# EAGLE schematic latchupWatchdog (EAGLE 6.1)
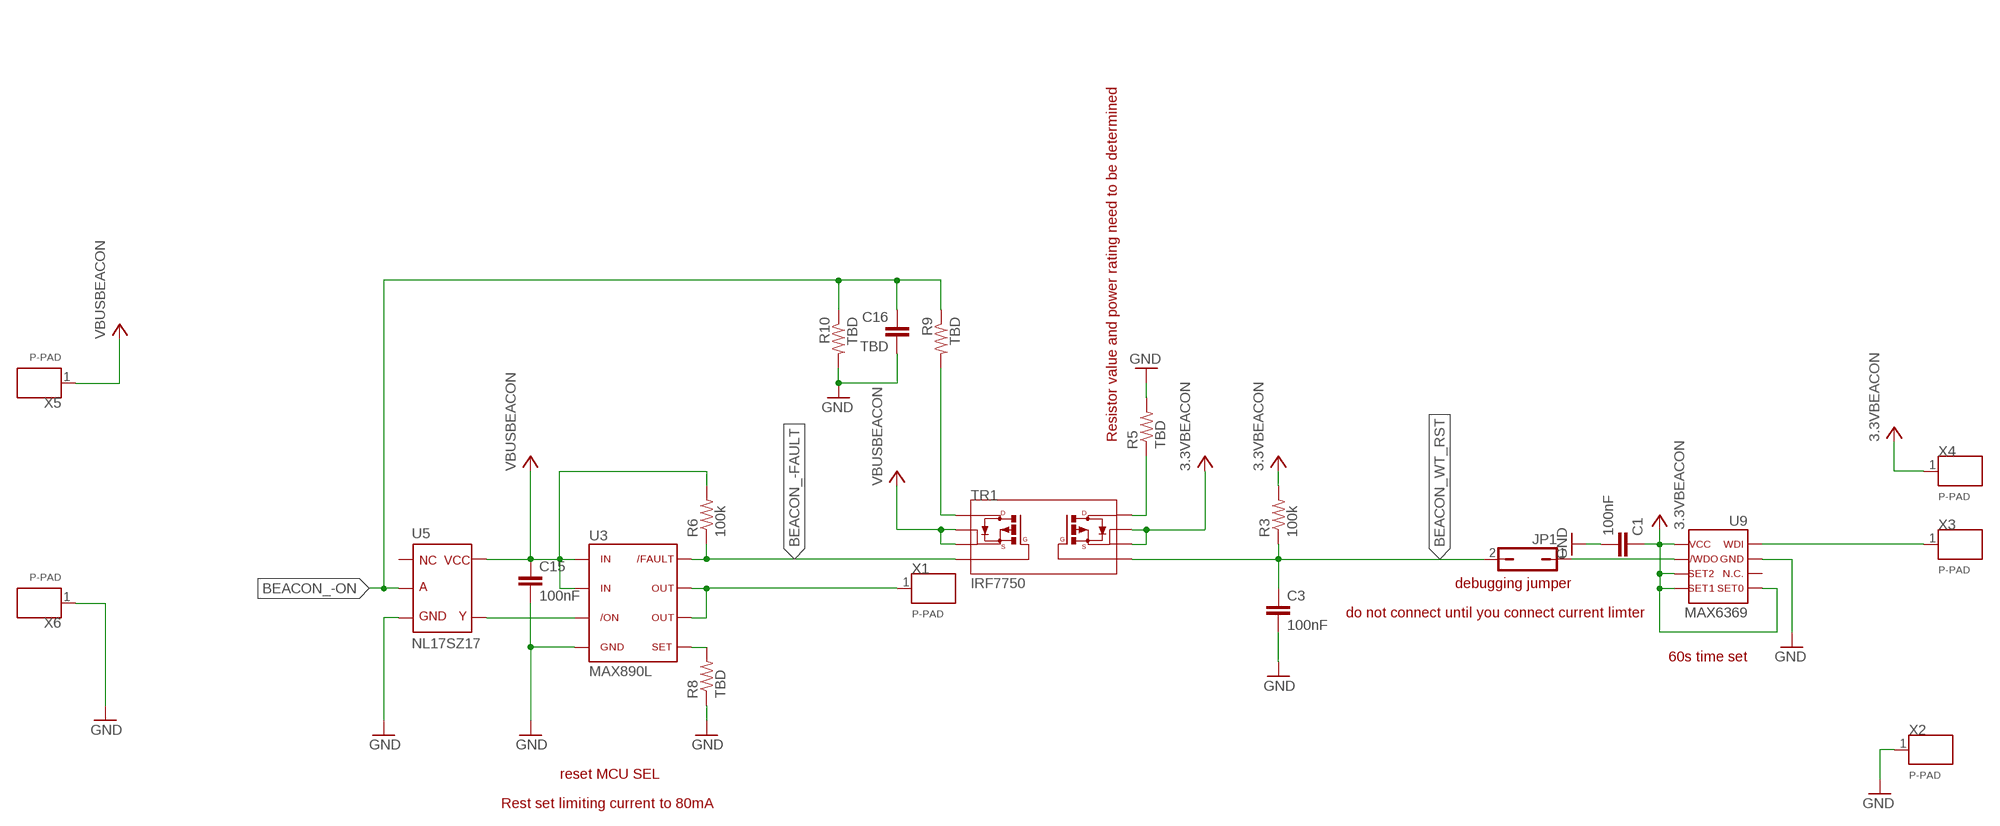
[diagram p0: schematic, sheet 1]

## Parts
C1  100nF  C0603(1608)  [C0603(1608)]
C3  100nF  C0603(1608)  [C0603(1608)]
C15  100nF  C0603(1608)  [C0603(1608)]
C16  TBD  C0603(1608)  [C0603(1608)]
JP1  JP1Q  [JP1]
R3  100k  R0603(1608)  [R0603(1608)]
R5  TBD  R0805(2012)  [R0805(2012)]
R6  100k  R0603(1608)  [R0603(1608)]
R8  TBD  R0603(1608)  [R0603(1608)]
R9  TBD  R0603(1608)  [R0603(1608)]
R10  TBD  R0603(1608)  [R0603(1608)]
TR1  IRF7750  [TSSOP-8]
U3  MAX890L  [SO8]
U5  NL17SZ17  [SOT-553]
U9  MAX6369  [SOT23-8]
X1  P-PAD  [P-PAD]
X2  P-PAD  [P-PAD]
X3  P-PAD  [P-PAD]
X4  P-PAD  [P-PAD]
X5  P-PAD  [P-PAD]
X6  P-PAD  [P-PAD]

## Nets
3.3VBEACON: C1.1 R3.2 TR1.6 TR1.7 U9.4 U9.5 U9.6 U9.8 X4.1
BEACON_-FAULT: R6.1 TR1.4 U3.8
BEACON_-ON: C16.1 R9.1 R10.1 U5.2
BEACON_WT_RST: C3.1 JP1.2 R3.1 TR1.5
GND: C1.2 C3.2 C15.2 C16.2 R5.2 R8.1 R10.2 U3.4 U5.3 U9.2 X2.1 X6.1
N$1: JP1.1 U9.7
N$2: U9.1 X3.1
N$4: R5.1 TR1.8
N$5: U3.6 U3.7 X1.1
N$10: R8.2 U3.5
N$13: U3.3 U5.4
N$20: R9.2 TR1.1
VBUSBEACON: C15.1 R6.2 TR1.2 TR1.3 U3.1 U3.2 U5.5 X5.1
Unconnected: U5.1 U9.3

## Notes on the sheet
- Resistor value and power rating need to be determined
- debugging jumper
- do not connect until you connect current limter
- 60s time set
- reset MCU SEL
- Rest set limiting current to 80mA

## Library data of the parts
C1 C3 C15 C16 = OSSI:C
JP1 = OSSI:JP1Q: JUMPER
R3 R5 R6 R8-R10 = OSSI:R
TR1 = OSSI:IRF7750: IRF7750 Dual P-channel MOSFET Vdss = -20V Rds(on) = 0.030 Ohm Id = 3.8A at(70 celsius degree) Vgs = -1.2V max
U3 = OSSI:MAX890L: MAX 890L 1.2A, Current-Limited, High-Side P-Channel Switch with Thermal Shutdown BY MAXIM
U5 = OSSI:NL17SZ17: NL17S17 Single Non-Iverting Buffer with Schmitt Trigger Source/Sink 24mA at 3.0 Volts 1.65V ~ 5.5V Vcc Operation
U9 = OSSI:MAX6369: MAX6369 Pin-Selectable Watchdog Timers Max 6369 is Open-drain output 1 ms to 60 s seletable timeout
X1-X6 = OSSI:P-PAD